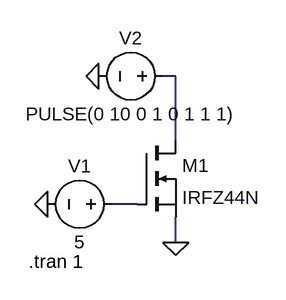
[diagram p0: schematic nmos.asc]
nmos.asc, the LTspice schematic file:
Version 4.1
SHEET 1 880 680
WIRE 192 48 176 48
WIRE 192 128 192 48
WIRE 144 208 112 208
WIRE 192 256 192 224
FLAG 192 256 0
FLAG 32 208 0
FLAG 96 48 0
SYMBOL voltage 128 208 R90
WINDOW 0 -32 56 VBottom 2
WINDOW 3 32 56 VTop 2
WINDOW 123 0 0 Left 0
WINDOW 39 0 0 Left 0
SYMATTR InstName V1
SYMATTR Value 5
SYMBOL voltage 192 48 R90
WINDOW 0 -32 56 VBottom 2
WINDOW 3 32 56 VTop 2
WINDOW 123 0 0 Left 0
WINDOW 39 0 0 Left 0
SYMATTR InstName V2
SYMATTR Value PULSE(0 10 0 1 0 1 1 1)
SYMBOL nmos 144 128 R0
SYMATTR InstName M1
SYMATTR Value IRFZ44N
TEXT 8 280 Left 2 !.tran 1

The netlist it stands for:
* nmos.asc
V1 N002 0 5
V2 N001 0 PULSE(0 10 0 1 0 1 1 1)
M1 N001 N002 0 0 IRFZ44N
.model NMOS NMOS
.model PMOS PMOS
.lib standard.mos
.tran 1
.backanno
.end